# Altium schematic sheet Communication.SchDoc
size A4
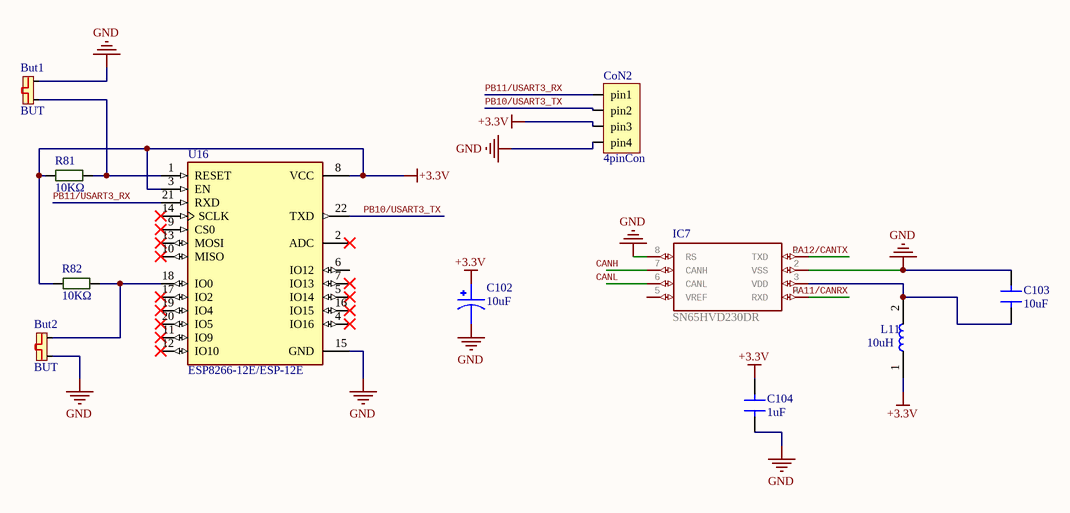
[diagram p0: Communication.SchDoc]

## Parts
But1  BUT  [ButTON]
But2  BUT  [ButTON]
C102  10uF  [CapSmdElc]
C103  10uF  [C-0805]
C104  1uF  [C-0603W]
CoN2  4pinCon  [4pinCon]
IC7  SN65HVD230DR  [SO08]
L11  10uH  [INDC2012X87N]
R81  10KΩ  [R-0603R]
R82  10KΩ  [R-0603R]
U16  ESP8266-12E/ESP-12E  [XCVR_ESP8266-12E/ESP-12E]

## Nets
+3.3V: C102.1 C104.2 CoN2.3(pin3) L11.1 R81.1 R82.1 U16.3(EN) U16.8(VCC)
GND: But1.2 But2.1 C102.2 C103.2 C104.1 CoN2.4(pin4) IC7.2(VSS) IC7.8(RS) U16.15(GND)
CANH: IC7.7(CANH)
CANL: IC7.6(CANL)
PA11/CANRX: IC7.4(RXD)
PA12/CANTX: IC7.1(TXD)
PB10/USART3_TX: CoN2.2(pin2) U16.22(TXD)
PB11/USART3_RX: CoN2.1(pin1) U16.21(RXD)
NetBut1_1: But1.1 R81.2 U16.1(RESET)
NetBut2_2: But2.2 R82.2 U16.18(IO0)
NetC103_1: C103.1 IC7.3(VDD) L11.2

Not connected (* = marked no-connect by the designer): IC7 5(VREF); U16 2(ADC)* 4(IO16)* 5(IO14)* 6(IO12) 7(IO13)* 9(CS0)* 10(MISO)* 11(IO9)* 12(IO10)* 13(MOSI)* 14(SCLK)* 16(IO15)* 17(IO2)* 19(IO4)* 20(IO5)*

## Library data of the parts
C102 = 100 uF Electr Cap
C103 = C-0805
C104 = C-0603
IC7 = MCP2551: CAN transceiver; GateName_1: G$1; SymbolName_1: MCP2551; LibraryName: SparkFun-DigitalIC; DeviceSetName: MCP2551
L11 = MLZ2012M100HTD25: FIXED IND 10UH 300MA 884 MOHM; Package: None; Price: None; Value: *; MP: MLZ2012M100HTD25; Availability: Unavailable
R81 R82 = R-0603
U16 = ESP8266-12E/ESP-12E: This WiFi module has a 32-bit MCU micro and clock speeds supporting 80 MHz or 160 MHz. Supports the RTOS and integrated Wi-Fi MAC/BB/RF/PA/LNA, and has an on-board antenna.; MF: AI-Thinker; Price: None; Package: None; Value: *; MP: ESP8266-12E/ESP-12E; Availability: Unavailable; SnapEDA_Link: https://www.snapeda.com/parts/ESP8266-12E/ESP-12E/AI-Thinker/view-part/106414/?ref=snap